# Altium schematic sheet 6.Voltage_regulators.SchDoc
size A3; SheetNumber: 7; SheetTotal: 13
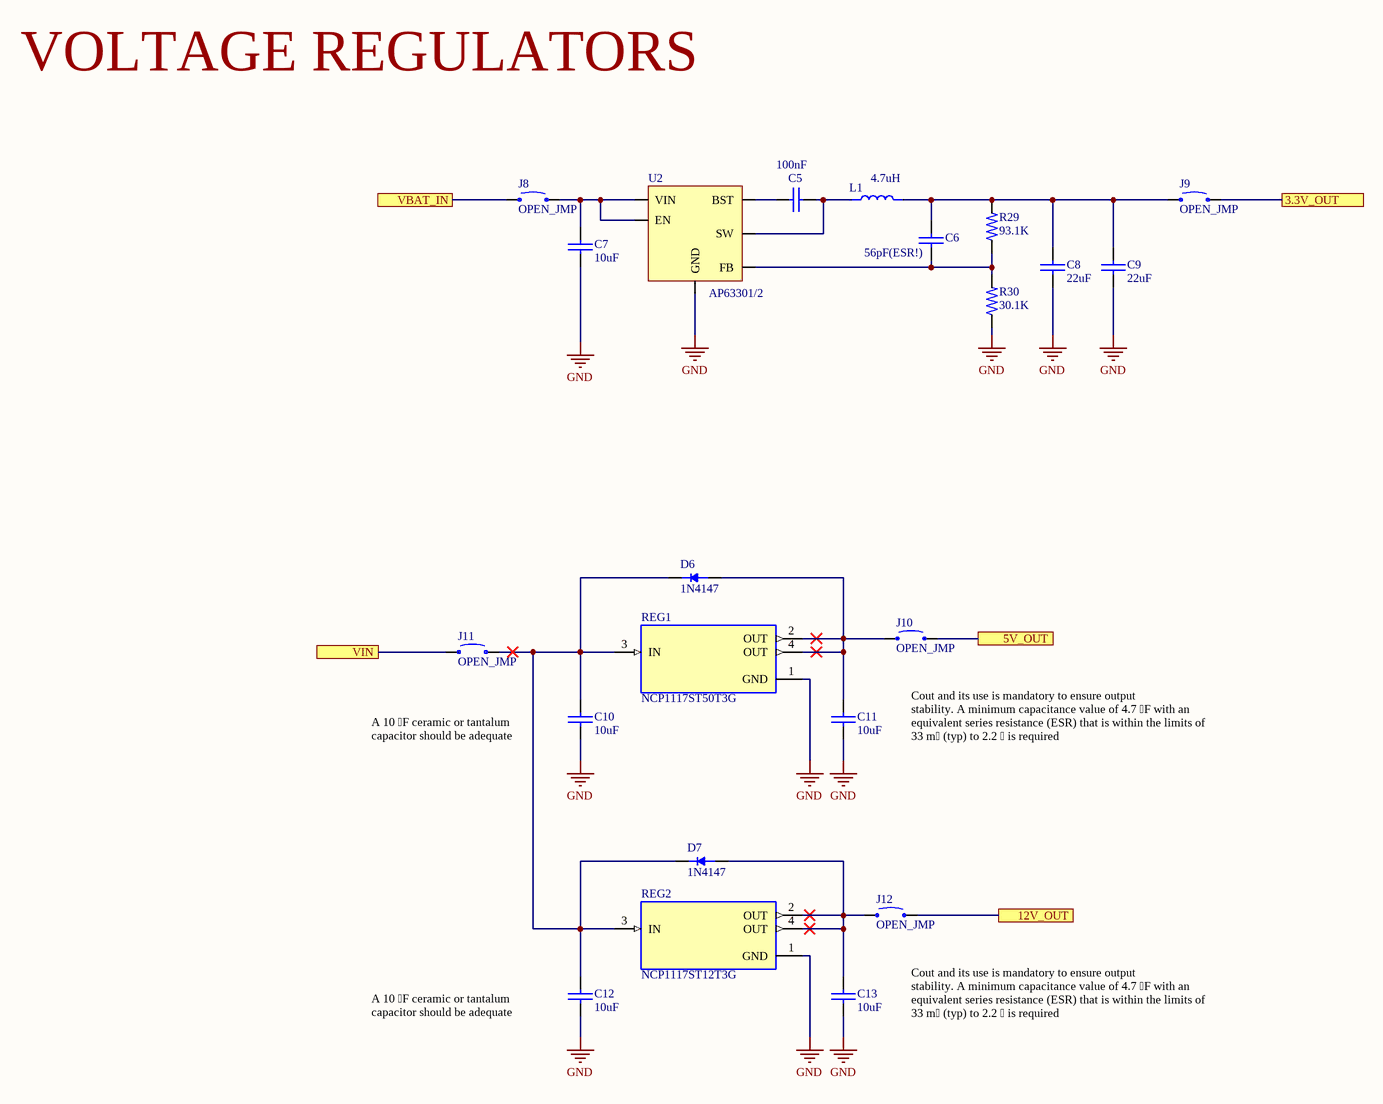
[diagram p0: 6.Voltage_regulators.SchDoc]

## Parts
C5  100nF  [C_0603]
C6  56pF(ESR!)  [C_0603]
C7  10uF  [C_0603]
C8  22uF  [C_0603]
C9  22uF  [C_0603]
C10  10uF  [C_0603]
C11  10uF  [C_0603]
C12  10uF  [C_0603]
C13  10uF  [C_0603]
D6  1N4147  [SOD123]
D7  1N4147  [SOD123]
J8  OPEN_JMP  [OPEN_JMP]
J9  OPEN_JMP  [OPEN_JMP]
J10  OPEN_JMP  [OPEN_JMP]
J11  OPEN_JMP  [OPEN_JMP]
J12  OPEN_JMP  [OPEN_JMP]
L1  4.7uH
R29  93.1K  [R_0603]
R30  30.1K  [R_0603]
REG1  NCP1117ST50T3G  [SOT-223]
REG2  NCP1117ST12T3G  [SOT-223]
U2  AP63301/2  [SOT-23-6]

## Ports
3.3V_OUT, 5V_OUT, 12V_OUT, VBAT_IN, VIN

## Nets
GND: C7.1 C8.1 C9.1 C10.1 C11.1 C12.1 C13.1 R30.1 REG1.1(GND) REG2.1(GND) U2.4(GND)
3.3V_OUT: J9.2 ; port 3.3V_OUT
5V_OUT: J10.2 ; port 5V_OUT
12V_OUT: J12.2 ; port 12V_OUT
VBAT_IN: J8.1 ; port VBAT_IN
VIN: J11.1 ; port VIN
NetC5_1: C5.1 U2.6(BST)
NetC5_2: C5.2 L1.1 U2.5(SW)
NetC6_1: C6.1 R29.1 R30.2 U2.1(FB)
NetC6_2: C6.2 C8.2 C9.2 J9.1 L1.2 R29.2
NetC7_2: C7.2 J8.2 U2.2(EN) U2.3(VIN)
NetC10_2: C10.2 C12.2 D6.C(K) D7.C(K) J11.2 REG1.3(IN) REG2.3(IN)
NetC11_2: C11.2 D6.A J10.1 REG1.2(OUT) REG1.4(OUT)
NetC13_2: C13.2 D7.A J12.1 REG2.2(OUT) REG2.4(OUT)

## Notes on the sheet
- VOLTAGE REGULATORS
- A 10 F ceramic or tantalum
  capacitor should be adequate
- Cout and its use is mandatory to ensure output
  stability. A minimum capacitance value of 4.7 F with an
  equivalent series resistance (ESR) that is within the limits of
  33 m (typ) to 2.2  is required

## Library data of the parts
C5-C13 = C_0603: D: *; MFR: *; P: *; PN: *; URL: *
D6 D7 = 1N4147: MFR: Panjit; PN: 1N4148W_R2_00001; D: Diodes - General Purpose, Power, Switching SURFACE MOUNT SWITCHING DIODES; P: SOD123; URL: https://www.mouser.in/ProductDetail/Panjit/1N4148W_R2_00001?qs=sPbYRqrBIVlsNrvmMQOkFA%3D%3D
L1 = VLS6045EX-4R7M: MFR: TDK; D: Power Inductors - SMD 4.7 UH; PN: VLS6045EX-4R7M; P: *; URL: https://www.mouser.in/ProductDetail/TDK/VLS6045EX-4R7M?qs=GtmDRopnxzp2p1TJ0mf3tQ%3D%3D
R29 R30 = R_0603: D: *; MFR: *; P: *; PN: *; URL: *
REG1 = NCP1117ST50T3G: MFR: onsemi; P: SOT-223-3; D: LDO Voltage Regulators 5.0V 1A Positive; PN: NCP1117ST50T3G; URL: https://www.mouser.in/ProductDetail/onsemi/NCP1117ST50T3G?qs=Gev%252BmEvV0ib6dijy6U0dhQ%3D%3D
REG2 = NCP1117ST12T3G: MFR: onsemi; PN: NCP1117ST50T3G; D: LDO Voltage Regulators 12.0V 1A Positive; P: SOT-223; URL: https://www.mouser.in/ProductDetail/onsemi/NCP1117ST12T3G?qs=Gev%252BmEvV0iYlVubarTuj5w%3D%3D
U2 = AP63301/2: MFR: Diodes Incorporated; P: TSOT26; PN: AP63301WU-7; D: Switching Voltage Regulators DCDC Conv HV Buck TSOT26 T&R 3K; URL: https://www.mouser.in/ProductDetail/Diodes-Incorporated/AP63301WU-7?qs=bZr6mbWTK5mxozg17S0lNg%3D%3D